# Altium project uMultimeter_ExpProbeA.PrjPCB
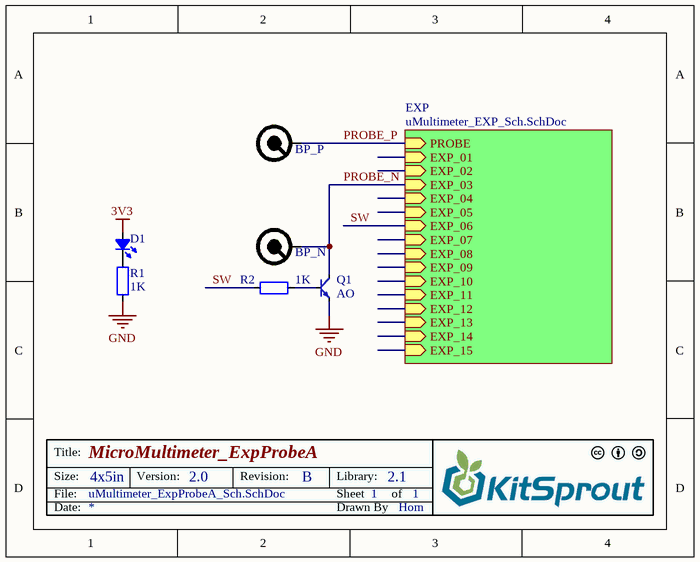
[diagram p0: uMultimeter_ExpProbeA_Sch.SchDoc]
2 sheets, 7 parts. Net scope: hierarchical (ports join the sheet entries above them; power ports are global).
Board file: uMultimeter_ExpProbeA_Pcb.PcbDoc
Sheets:
  uMultimeter_ExpProbeA_Sch.SchDoc
    EXP = uMultimeter_EXP_Sch.SchDoc

## Sheet uMultimeter_ExpProbeA_Sch.SchDoc: MicroMultimeter_ExpProbeA
size 127 x 101 mm; Author: Hom; CompanyName: KitSprout; DrawnBy: Hom; Engineer: Hom; Organization: KitSprout; Revision: B; SheetNumber: 1; SheetTotal: 1; License: CC BY-SA 4.0; Version: 2.0; LibVersion: 2.1; PageSetup: Record=PageOptions|CenterHorizontal=True|CenterVertical=True|PrintScale=1.00|XCorrection=1.00|YCorrection=1.00|PrintKind=0|BorderSize=5000000|LeftOffset=0|BottomOffset=0|Orientation=2|PaperLength=1000|PaperWidth=1000|Scale=100|PaperSource=7|PrintQuality=-3|MediaType=1|DitherType=10|PrintScaleMode=0|PaperKind=A4|PaperIndex=9

### Parts
BP_N  BananaPlugs  [BananaPlugs_Black]  (value not drawn)
BP_P  BananaPlugs  [BananaPlugs_Red]  (value not drawn)
D1  LED_0805  [LED_0805_BLUE]  (value not drawn)
Q1  value AO  [SOT23-3]  (hidden comment: BJT_NPN)
R1  value 1K  [RES_0603]  (hidden comment: Res_0603)
R2  value 1K  [RES_0603]  (hidden comment: Res_0603)

### Sub-sheets
EXP = uMultimeter_EXP_Sch.SchDoc: PROBE (in), EXP_01 (in), EXP_02 (in), EXP_03 (in), EXP_04 (in), EXP_05 (in), EXP_06 (in), EXP_07 (in), EXP_08 (in), EXP_09 (in), EXP_10 (in), EXP_11 (in), EXP_12 (in), EXP_13 (in), EXP_14 (in), EXP_15 (in)

### Nets
3V3: D1.1(A)
GND: Q1.2(E) R1.2
PROBE_N: BP_N.1 Q1.3(C) ; sheet EXP/EXP_03
PROBE_P: BP_P.1 ; sheet EXP/PROBE
SW: R2.1 ; sheet EXP/EXP_06
NetD1_2: D1.2(K) R1.1
NetQ1_1: Q1.1(B) R2.2

### Notes on the sheet
- Title:
- Size:
- Date:
- File:
- 4x5in
- Version:
- Revision:
- Sheet
- Drawn By
- Library:
- of

### Library data of the parts
D1 = LED_0805: LED
Q1 = BJT_NPN: Transistor
R1 R2 = Res_0603: Resistor

## Sheet uMultimeter_EXP_Sch.SchDoc: MicroMultimeter - EXP
size 127 x 101 mm; Author: Hom; CompanyName: KitSprout; DrawnBy: Hom; Engineer: Hom; Organization: KitSprout; Revision: A; SheetNumber: 1; SheetTotal: 1; License: CC BY-SA 4.0; Version: 2.0; LibVersion: 2.0; PageSetup: Record=PageOptions|CenterHorizontal=True|CenterVertical=True|PrintScale=1.00|XCorrection=1.00|YCorrection=1.00|PrintKind=0|BorderSize=5000000|LeftOffset=0|BottomOffset=0|Orientation=2|PaperLength=1000|PaperWidth=1000|Scale=100|PaperSource=7|PrintQuality=-3|MediaType=1|DitherType=10|PrintScaleMode=0|PaperKind=A4|PaperIndex=9
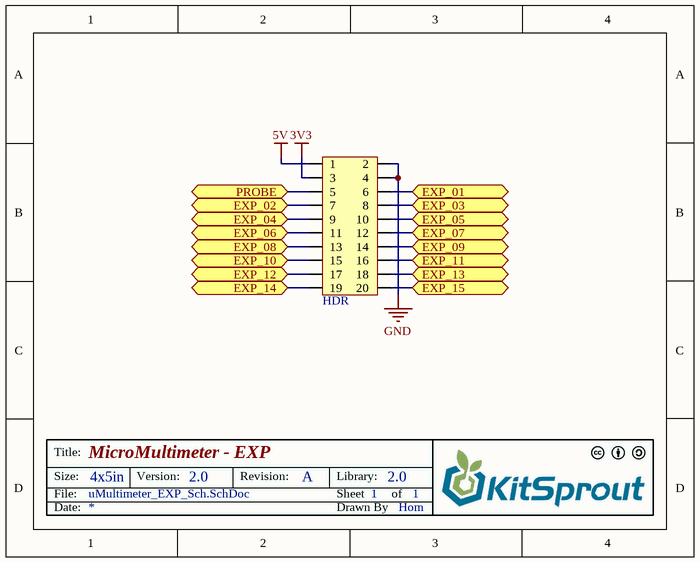
[diagram p1: uMultimeter_EXP_Sch.SchDoc]

### Parts
HDR  HDR2x10_2.54  [HDR2X10_2.54_180H]  (value not drawn)

### Ports
EXP_01, EXP_02, EXP_03, EXP_04, EXP_05, EXP_06, EXP_07, EXP_08, EXP_09, EXP_10, EXP_11, EXP_12, EXP_13, EXP_14, EXP_15, PROBE

### Nets
3V3: HDR.3
5V: HDR.1
GND: HDR.2 HDR.4
PROBE_N: HDR.8 ; port EXP_03
PROBE_P: HDR.5 ; port PROBE
SW: HDR.11 ; port EXP_06
NetHDR_6: HDR.6 ; port EXP_01
NetHDR_7: HDR.7 ; port EXP_02
NetHDR_9: HDR.9 ; port EXP_04
NetHDR_10: HDR.10 ; port EXP_05
NetHDR_12: HDR.12 ; port EXP_07
NetHDR_13: HDR.13 ; port EXP_08
NetHDR_14: HDR.14 ; port EXP_09
NetHDR_15: HDR.15 ; port EXP_10
NetHDR_16: HDR.16 ; port EXP_11
NetHDR_17: HDR.17 ; port EXP_12
NetHDR_18: HDR.18 ; port EXP_13
NetHDR_19: HDR.19 ; port EXP_14
NetHDR_20: HDR.20 ; port EXP_15

### Notes on the sheet
- Title:
- Size:
- Date:
- File:
- 4x5in
- Version:
- Revision:
- Sheet
- Drawn By
- Library:
- of

### Library data of the parts
HDR = HDR2x10_2.54: Header

## Nets that join several sheets
3V3: uMultimeter_ExpProbeA_Sch (D1.1), uMultimeter_EXP_Sch (HDR.3)
GND: uMultimeter_ExpProbeA_Sch (Q1.2 R1.2), uMultimeter_EXP_Sch (HDR.2 HDR.4)
PROBE_N: uMultimeter_ExpProbeA_Sch (BP_N.1 Q1.3), uMultimeter_EXP_Sch (HDR.8)
PROBE_P: uMultimeter_ExpProbeA_Sch (BP_P.1), uMultimeter_EXP_Sch (HDR.5)
SW: uMultimeter_ExpProbeA_Sch (R2.1), uMultimeter_EXP_Sch (HDR.11)